# EAGLE design ledrgbmatrix_arjun_with10mil clearence (EAGLE 7.7.0)
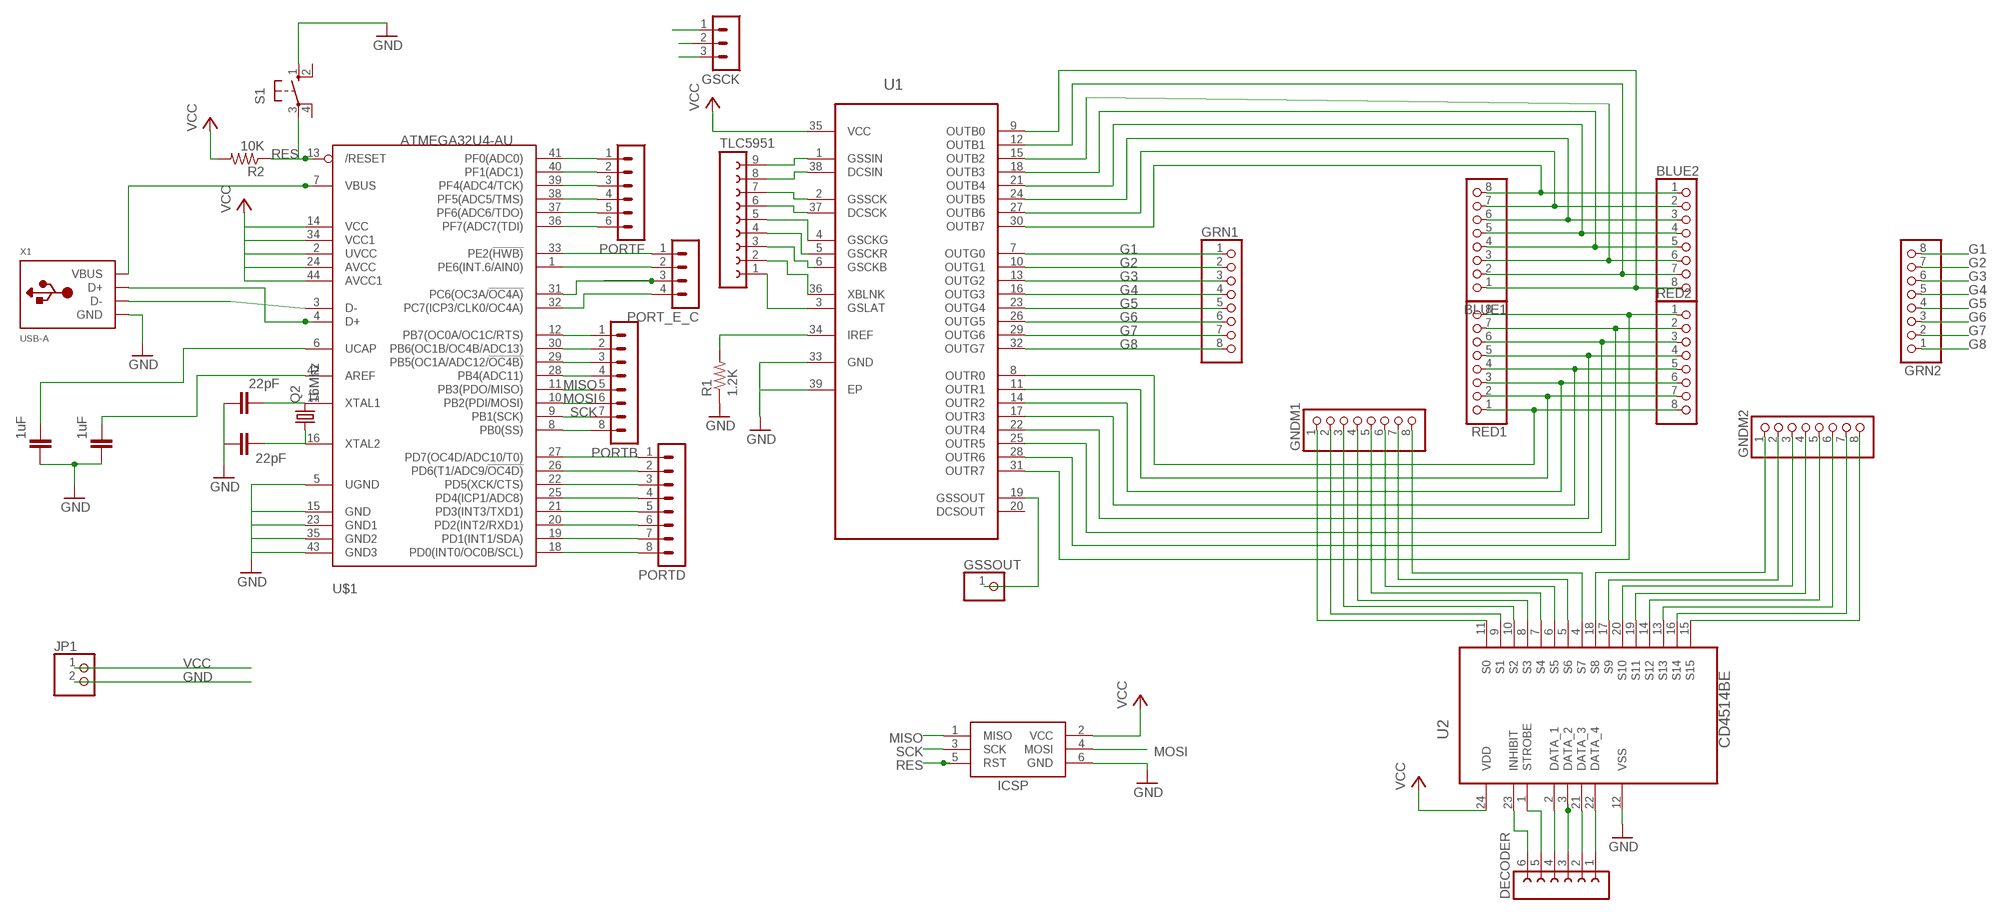
[diagram p0: schematic, sheet 1]

## Parts
BLUE1  PINHD-1X8BIG  [1X08-BIG]
BLUE2  PINHD-1X8BIG  [1X08-BIG]
C1  1uF  C2.5/2  [C2.5-2]
C2  1uF  C2.5/2  [C2.5-2]
C3  22pF  C2.5/2  [C2.5-2]
C4  22pF  C2.5/2  [C2.5-2]
DECODER  FE06-1  [FE06]
GNDM1  PINHD-1X8BIG  [1X08-BIG]
GNDM2  PINHD-1X8BIG  [1X08-BIG]
GRN1  PINHD-1X8BIG  [1X08-BIG]
GRN2  PINHD-1X8BIG  [1X08-BIG]
GSCK  MA03-1  [MA03-1]
GSSOUT  PINHD-1X1  [1X01]
ICSP  AVRISP-6  [AVRISP]
JP1  PINHD-1X2  [1X02]
PORT_E_C  MA04-1  [MA04-1]
PORTB  MA08-1  [MA08-1]
PORTD  MA08-1  [MA08-1]
PORTF  MA06-1  [MA06-1]
Q2  16Mhz  CRYSTALHC49U-V  [HC49U-V]
R1  1.2K  R-US_0207/12  [0207/12]
R2  10K  R-US_0207/12  [0207/12]
RED1  PINHD-1X8BIG  [1X08-BIG]
RED2  PINHD-1X8BIG  [1X08-BIG]
S1  10-XX  [B3F-10XX]
TLC5951  FE09-1  [FE09]
U1  TLC5951DAP  [SOP65P810X120-39N]
U2  CD4514BE  [DIP254P1080X508-24]
U$1  ATMEGA32U4-AU  [TQFP44]
X1  USB-A  [MOLEX_480371000]

## Nets
AREF: C1.2 U$1.42(AREF)
B1: BLUE1.1 BLUE2.8 U1.9(OUTB0)
B2: BLUE1.2 BLUE2.7 U1.12(OUTB1)
B3: BLUE1.3 BLUE2.6 U1.15(OUTB2)
B4: BLUE1.4 BLUE2.5 U1.18(OUTB3)
B5: BLUE1.5 BLUE2.4 U1.21(OUTB4)
B6: BLUE1.6 BLUE2.3 U1.24(OUTB5)
B7: BLUE1.7 BLUE2.2 U1.27(OUTB6)
B8: BLUE1.8 BLUE2.1 U1.30(OUTB7)
C0: GNDM1.1 U2.11(S0)
C1: GNDM1.2 U2.9(S1)
C2: GNDM1.3 U2.10(S2)
C3: GNDM1.4 U2.8(S3)
C4: GNDM1.5 U2.7(S4)
C5: GNDM1.6 U2.6(S5)
C6: GNDM1.7 U2.5(S6)
C7: GNDM1.8 U2.4(S7)
C8: GNDM2.1 U2.18(S8)
C9: GNDM2.2 U2.17(S9)
C10: GNDM2.3 U2.20(S10)
C11: GNDM2.4 U2.19(S11)
C12: GNDM2.5 U2.14(S12)
C13: GNDM2.6 U2.13(S13)
C14: GNDM2.7 U2.16(S14)
C15: GNDM2.8 U2.15(S15)
D1: DECODER.4 U2.2(DATA_1)
D2: DECODER.3 U2.3(DATA_2)
D3: DECODER.2 U2.21(DATA_3)
D4: DECODER.1 U2.22(DATA_4)
D+: U$1.4(D+) X1.3(D+)
D-: U$1.3(D-) X1.2(D-)
DCSCK: TLC5951.6 U1.37(DCSCK)
DSCIN: TLC5951.8 U1.38(DCSIN)
G1: GRN1.1 GRN2.8 U1.7(OUTG0)
G2: GRN1.2 GRN2.7 U1.10(OUTG1)
G3: GRN1.3 GRN2.6 U1.13(OUTG2)
G4: GRN1.4 GRN2.5 U1.16(OUTG3)
G5: GRN1.5 GRN2.4 U1.23(OUTG4)
G6: GRN1.6 GRN2.3 U1.26(OUTG5)
G7: GRN1.7 GRN2.2 U1.29(OUTG6)
G8: GRN1.8 GRN2.1 U1.32(OUTG7)
GND: C1.1 C2.1 C3.1 C4.1 ICSP.6(GND) JP1.2 R1.1 S1.1(S) U1.33(GND) U1.39(EP) U2.12(VSS) U$1.5(UGND) U$1.15(GND) U$1.23(GND1) U$1.35(GND2) U$1.43(GND3) X1.4(GND)
GSCKB: TLC5951.3 U1.6(GSCKB)
GSCKG: TLC5951.5 U1.4(GSCKG)
GSCKR: TLC5951.4 U1.5(GSCKR)
GSLAT: TLC5951.1 U1.3(GSLAT)
GSSCK: GSCK.2 TLC5951.7 U1.2(GSSCK)
GSSIN: TLC5951.9 U1.1(GSSIN)
GSSOUT: GSSOUT.1 U1.19(GSSOUT)
INHIBIT: DECODER.6 U2.23(INHIBIT)
IREF: R1.2 U1.34(IREF)
MISO: ICSP.1(MISO) PORTB.5 U$1.11(PB3(PDO/MISO))
MOSI: ICSP.4(MOSI) PORTB.6 U$1.10(PB2(PDI/MOSI))
PB0: PORTB.8 U$1.8(PB0(SS))
PB4: PORTB.4 U$1.28(PB4(ADC11))
PB5: PORTB.3 U$1.29(PB5(OC1A/ADC12/!OC4B))
PB6: PORTB.2 U$1.30(PB6(OC1B/OC4B/ADC13))
PB7: PORTB.1 U$1.12(PB7(OC0A/OC1C/RTS))
PC6: PORT_E_C.3 U$1.31(PC6(OC3A/!OC4A))
PC7: PORT_E_C.4 U$1.32(PC7(ICP3/CLK0/OC4A))
PD0: PORTD.8 U$1.18(PD0(INT0/OC0B/SCL))
PD1: PORTD.7 U$1.19(PD1(INT1/SDA))
PD2: PORTD.6 U$1.20(PD2(INT2/RXD1))
PD3: PORTD.5 U$1.21(PD3(INT3/TXD1))
PD4: PORTD.4 U$1.25(PD4(ICP1/ADC8))
PD5: PORTD.3 U$1.22(PD5(XCK/CTS))
PD6: PORTD.2 U$1.26(PD6(T1/ADC9/!OC4D))
PD7: PORTD.1 U$1.27(PD7(OC4D/ADC10/T0))
PE2: PORT_E_C.1 U$1.33(PE2(!HWB))
PE6: PORT_E_C.2 U$1.1(PE6(INT.6/AIN0))
PF0: PORTF.1 U$1.41(PF0(ADC0))
PF1: PORTF.2 U$1.40(PF1(ADC1))
PF4: PORTF.3 U$1.39(PF4(ADC4/TCK))
PF5: PORTF.4 U$1.38(PF5(ADC5/TMS))
PF6: PORTF.5 U$1.37(PF6(ADC6/TDO))
PF7: PORTF.6 U$1.36(PF7(ADC7(TDI))
R1: RED1.1 RED2.8 U1.8(OUTR0)
R2: RED1.2 RED2.7 U1.11(OUTR1)
R3: RED1.3 RED2.6 U1.14(OUTR2)
R4: RED1.4 RED2.5 U1.17(OUTR3)
R5: RED1.5 RED2.4 U1.22(OUTR4)
R6: RED1.6 RED2.3 U1.25(OUTR5)
R7: RED1.7 RED2.2 U1.28(OUTR6)
R8: RED1.8 RED2.1 U1.31(OUTR7)
RES: ICSP.5(RST) R2.1 S1.3(P) U$1.13(/RESET)
SCK: ICSP.3(SCK) PORTB.7 U$1.9(PB1(SCK))
STROBE: DECODER.5 U2.1(STROBE)
UCAP: C2.2 U$1.6(UCAP)
VBUS: U$1.7(VBUS) X1.1(VBUS)
VCC: ICSP.2(VCC) JP1.1 R2.2 U1.35(VCC) U2.24(VDD) U$1.2(UVCC) U$1.14(VCC) U$1.24(AVCC) U$1.34(VCC1) U$1.44(AVCC1)
XBLINK: TLC5951.2 U1.36(XBLNK)
XTAL1: C3.2 Q2.2 U$1.17(XTAL1)
XTAL2: C4.2 Q2.1 U$1.16(XTAL2)
Unconnected: GSCK.1 GSCK.3 S1.2(S1) S1.4(P1) U1.20(DCSOUT)

## Library data of the parts
BLUE1 BLUE2 GNDM1 GNDM2 GRN1 GRN2 RED1 RED2 = adafruit:PINHD-1X8: PIN HEADER
C1-C4 = capacitor-wima:C: CAPACITOR naming: grid - package width
DECODER = con-lsta:FE06-1: FEMALE HEADER; OC_FARNELL: unknown; OC_NEWARK: unknown
GSCK = con-lstb:MA03-1: PIN HEADER; OC_FARNELL: unknown; OC_NEWARK: unknown
GSSOUT = pinhead:PINHD-1X1: PIN HEADER
ICSP = adafruit:AVRISP: AVR ISP HEADER Standard 6 pin header for AVR programming
JP1 = pinhead:PINHD-1X2: PIN HEADER
PORT_E_C = con-lstb:MA04-1: PIN HEADER; OC_FARNELL: unknown; OC_NEWARK: unknown
PORTB PORTD = con-lstb:MA08-1: PIN HEADER; OC_FARNELL: unknown; OC_NEWARK: unknown
PORTF = con-lstb:MA06-1: PIN HEADER; OC_FARNELL: unknown; OC_NEWARK: unknown
Q2 = adafruit:CRYSTAL: CRYSTAL; OC_FARNELL: 1666969; OC_NEWARK: unknown
R1 R2 = rcl:R-US_: RESISTOR, American symbol
S1 = switch-omron:10-XX: OMRON SWITCH; MPN: B3F-1000; OC_FARNELL: 176432; OC_NEWARK: 36M3542
TLC5951 = con-lsta:FE09-1: FEMALE HEADER; OC_FARNELL: unknown; OC_NEWARK: unknown
U1 = Texas Instruments_By_element14_Batch_1:TLC5951DAP: 12-Bit PWM LED Driver; MPN: TLC5951DAP; OC_FARNELL: -; OC_NEWARK: 09R6488; PACKAGE: HTSSOP-38; SUPPLIER: Texas Instruments
U2 = Texas Instruments_By_element14_Batch_1:CD4514BE: CMOS 4 BIT LATCH /4-16 LINE DECODER; MPN: CD4514BE; OC_FARNELL: 1470801; OC_NEWARK: 60K5142; PACKAGE: 24-DIP; SUPPLIER: Texas Instruments
U$1 = adafruit:ATMEGA32U4: http://www.ladyada.net/library/eagle
X1 = adafruit:USB-A: USB type A 'plug' Used for things that can directly connect to a USB port, say USB key

## Net classes
0 default: width 0.254 mm, drill 0.508 mm, clearance 0.254 mm

## Board
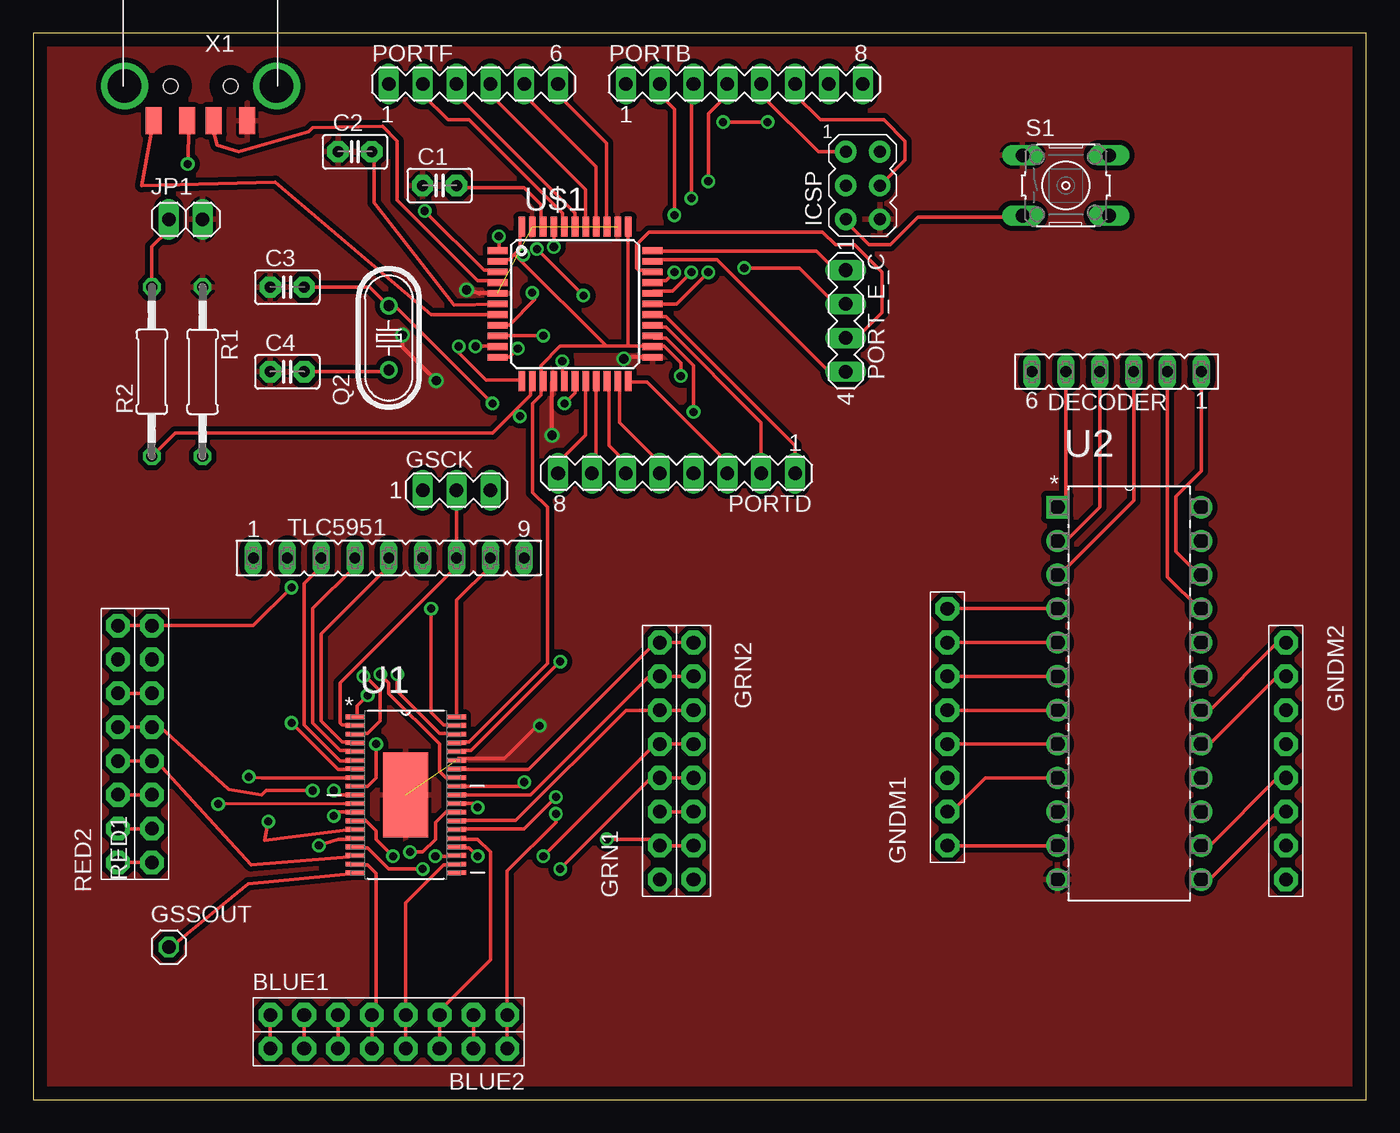
[diagram p1: board, top side]
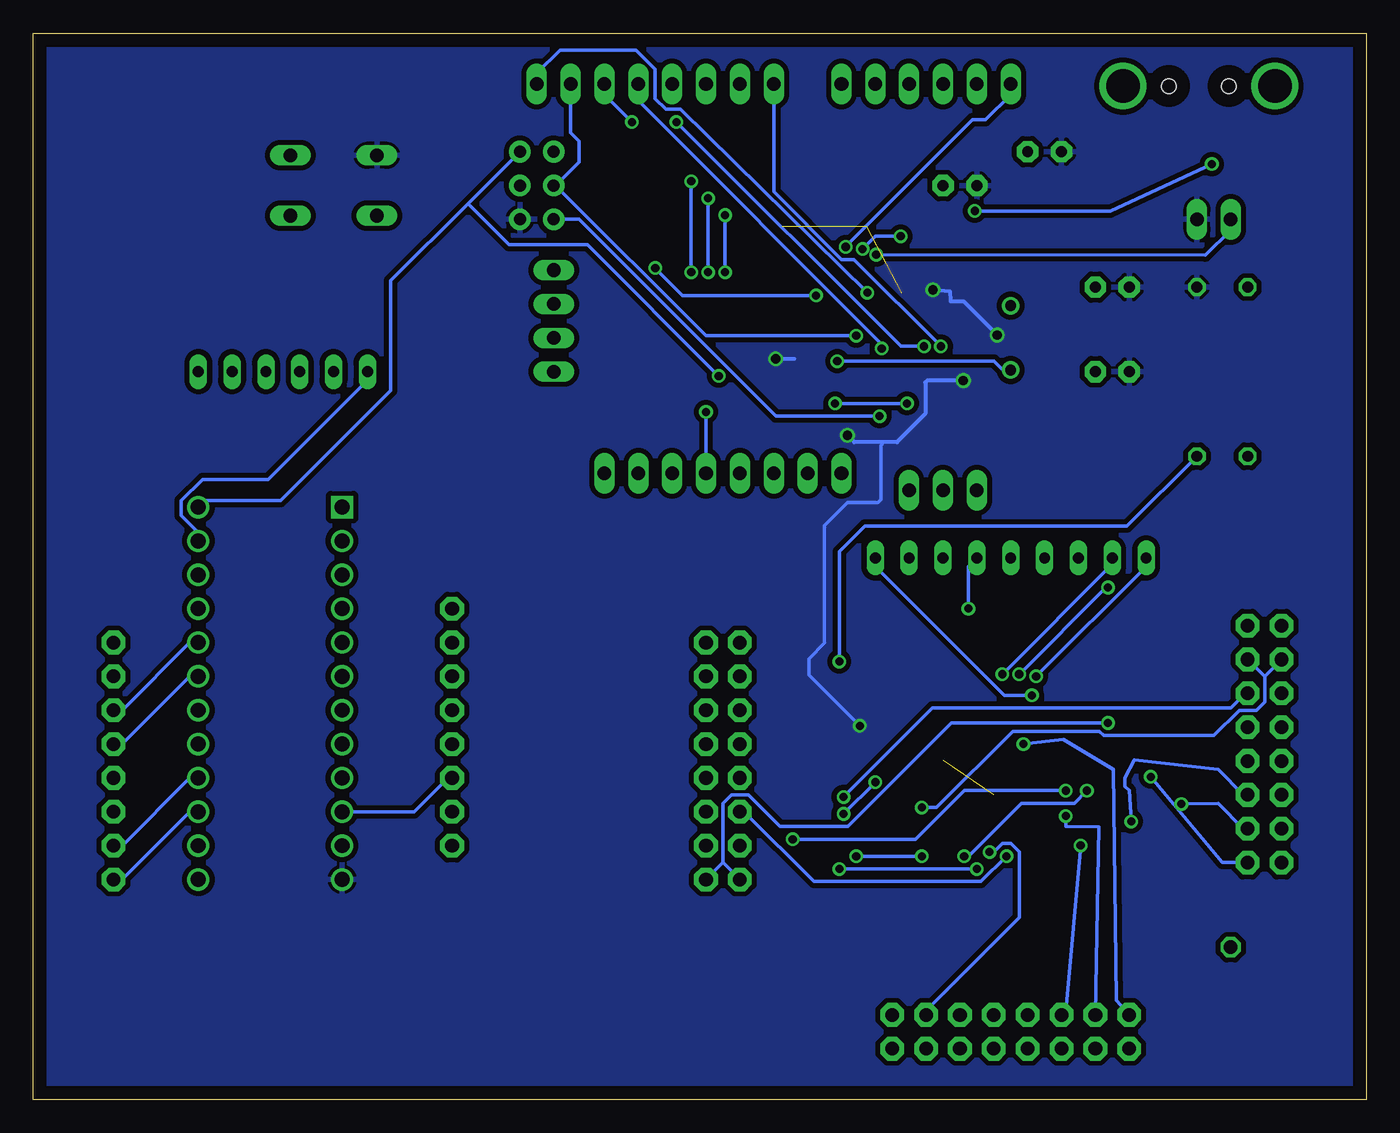
[diagram p2: board, bottom side, seen from below]

Size 100 x 80 mm. Coordinates in mm from the lower left corner, seen from the top.
Outline: 0,0 100,0 100,80 0,80 0,0
Copper layers (1*16): Top 0.035mm / dielectric 1.5mm / Bottom 0.035mm
Design rules "default *": minimum track width 10mil, minimum drill 24mil, track to track 15mil, track to pad 15mil, pad to pad 8mil, via to via 15mil, smd to smd 8mil, copper to edge 40mil, drill to drill 8mil, minimum pad ring 10mil, minimum via ring 8mil, stop-mask expansion 4mil, vias tented up to drill 0mil, thermal gap 10mil

### Footprints (pad centres in the part's own frame; a part is rotated, then mirrored left to right if it is on the bottom)
1X08-BIG = drill 1.016 pad 1.778 octagon: 1 -8.89,0; 2 -6.35,0; 3 -3.81,0; 4 -1.27,0; 5 1.27,0; 6 3.81,0; 7 6.35,0; 8 8.89,0
C2.5-2 = drill 0.813 pad 1.6 octagon: 1 -1.27,0; 2 1.27,0
FE06 = drill 0.813 long: 1 -6.35,0; 2 -3.81,0; 3 -1.27,0; 4 1.27,0; 5 3.81,0; 6 6.35,0
MA03-1 = drill 1.016 long: 1 -2.54,0; 2 0,0; 3 2.54,0
1X01 = drill 1.016 octagon: 1 0,0
AVRISP = drill 0.9 pad 1.626: 1 -1.27,2.54; 2 1.27,2.54; 3 -1.27,0; 4 1.27,0; 5 -1.27,-2.54; 6 1.27,-2.54
1X02 = drill 1.016 long: 1 -1.27,0; 2 1.27,0
MA04-1 = drill 1.016 long: 1 -3.81,0; 2 -1.27,0; 3 1.27,0; 4 3.81,0
MA08-1 = drill 1.016 long: 1 -8.89,0; 2 -6.35,0; 3 -3.81,0; 4 -1.27,0; 5 1.27,0; 6 3.81,0; 7 6.35,0; 8 8.89,0
MA06-1 = drill 1.016 long: 1 -6.35,0; 2 -3.81,0; 3 -1.27,0; 4 1.27,0; 5 3.81,0; 6 6.35,0
HC49U-V = drill 0.813: 1 -2.413,0; 2 2.413,0
0207/12 = drill 0.813 octagon: 1 -6.35,0; 2 6.35,0
B3F-10XX = drill 1.016 long: 1 -3.251,2.261; 2 3.251,2.261; 3 -3.251,-2.261; 4 3.251,-2.261
FE09 = drill 0.813 long: 1 -10.16,0; 2 -7.62,0; 3 -5.08,0; 4 -2.54,0; 5 0,0; 6 2.54,0; 7 5.08,0; 8 7.62,0; 9 10.16,0
SOP65P810X120-39N = smd 1.473 x 0.356: 1 -3.785,5.842; 2 -3.785,5.207; 3 -3.785,4.547; 4 -3.785,3.912; 5 -3.785,3.251; 6 -3.785,2.591; 7 -3.785,1.956; 8 -3.785,1.295; 9 -3.785,0.66; 10 -3.785,0; 11 -3.785,-0.66; 12 -3.785,-1.295; 13 -3.785,-1.956; 14 -3.785,-2.591; 15 -3.785,-3.251; 16 -3.785,-3.912; 17 -3.785,-4.547; 18 -3.785,-5.207; 19 -3.785,-5.842; 20 3.785,-5.842; 21 3.785,-5.207; 22 3.785,-4.547; 23 3.785,-3.912; 24 3.785,-3.251; 25 3.785,-2.591; 26 3.785,-1.956; 27 3.785,-1.295; 28 3.785,-0.66; 29 3.785,0; 30 3.785,0.66; 31 3.785,1.295; 32 3.785,1.956; 33 3.785,2.591; 34 3.785,3.251; 35 3.785,3.912; 36 3.785,4.547; 37 3.785,5.207; 38 3.785,5.842 | smd 3.378 x 6.35: 39 0,0
DIP254P1080X508-24 = drill 1.118 square: 1 -10.795,27.94 | drill 1.118: 2 -10.795,25.4; 3 -10.795,22.86; 4 -10.795,20.32; 5 -10.795,17.78; 6 -10.795,15.24; 7 -10.795,12.7; 8 -10.795,10.16; 9 -10.795,7.62; 10 -10.795,5.08; 11 -10.795,2.54; 12 -10.795,0; 13 0,0; 14 0,2.54; 15 0,5.08; 16 0,7.62; 17 0,10.16; 18 0,12.7; 19 0,15.24; 20 0,17.78; 21 0,20.32; 22 0,22.86; 23 0,25.4; 24 0,27.94
TQFP44 = smd 1.5 x 0.5: 1 -5.8,4; 2 -5.8,3.2; 3 -5.8,2.4; 4 -5.8,1.6; 5 -5.8,0.8; 6 -5.8,0; 7 -5.8,-0.8; 8 -5.8,-1.6; 9 -5.8,-2.4; 10 -5.8,-3.2; 11 -5.8,-4; 23 5.8,-4; 24 5.8,-3.2; 25 5.8,-2.4; 26 5.8,-1.6; 27 5.8,-0.8; 28 5.8,0; 29 5.8,0.8; 30 5.8,1.6; 31 5.8,2.4; 32 5.8,3.2; 33 5.8,4 | smd 0.5 x 1.5: 12 -4,-5.8; 13 -3.2,-5.8; 14 -2.4,-5.8; 15 -1.6,-5.8; 16 -0.8,-5.8; 17 0,-5.8; 18 0.8,-5.8; 19 1.6,-5.8; 20 2.4,-5.8; 21 3.2,-5.8; 22 4,-5.8; 34 4,5.8; 35 3.2,5.8; 36 2.4,5.8; 37 1.6,5.8; 38 0.8,5.8; 39 0,5.8; 40 -0.8,5.8; 41 -1.6,5.8; 42 -2.4,5.8; 43 -3.2,5.8; 44 -4,5.8
MOLEX_480371000 = smd 1.2 x 2: 1 3.5,2.6; 2 1,2.6; 3 -1,2.6; 4 -3.5,2.6 | drill 2.5: M1 -5.7,0; M2 5.7,0 | hole 1.1: -2.25,0; 2.25,0

### Placement (x,y rotation side)
BLUE1  26.67,6.35 0 top
BLUE2  26.67,3.81 180 top
C1  30.48,68.58 0 top
C2  24.13,71.12 0 top
C3  19.05,60.96 0 top
C4  19.05,54.61 0 top
DECODER  81.28,54.61 180 top
GNDM1  68.58,27.94 90 top
GNDM2  93.98,25.4 270 top
GRN1  46.99,25.4 90 top
GRN2  49.53,25.4 270 top
GSCK  31.75,45.72 0 top
GSSOUT  10.16,11.43 0 top
ICSP  62.23,68.58 0 top
JP1  11.43,66.04 0 top
PORT_E_C  60.96,58.42 270 top
PORTB  53.34,76.2 0 top
PORTD  48.26,46.99 180 top
PORTF  33.02,76.2 0 top
Q2  26.67,57.15 90 top
R1  12.7,54.61 270 top
R2  8.89,54.61 90 top
RED1  8.89,26.67 90 top
RED2  6.35,26.67 270 top
S1  77.47,68.58 0 top
TLC5951  26.67,40.64 0 top
U1  27.94,22.86 0 top
U2  87.63,16.51 0 top
U$1  40.64,59.69 0 top
X1  12.55,76.05 180 top

### Tracks (layer width: path | path; a pad name or v marks a point on that pad's centre or on a via)
AREF
  Top 0.254: C1.2 31.91,68.42 36.83,68.42 38.1,67.15 38.1,65.56 U$1.42
B1  (via drill 0.61)
  Top 0.254: v25.72,26.67 25.72,24.13 25.08,23.5 24.29,23.5 U1.9 | BLUE1.1 BLUE2.8
  Bottom 0.254: v25.72,26.67 22.72,27.03 18.99,24.77 18.73,7.46 BLUE1.1
B2  (via drill 0.61)
  Top 0.254: v22.54,21.27 22.86,21.59 24.13,21.59 U1.12 | BLUE1.2 BLUE2.7
  Bottom 0.254: v22.54,21.27 22.54,20.48 20.07,20.44 BLUE1.2
B3  (via drill 0.61)
  Top 0.254: v21.43,19.06 22.86,19.53 24.13,19.53 U1.15 | BLUE1.3 BLUE2.6
  Bottom 0.254: v21.43,19.06 22.54,6.67 BLUE1.3
B4
  Top 0.254: U1.18 24.29,17.62 25.08,17.62 25.72,16.99 25.72,6.67 BLUE1.4 BLUE2.5
B5
  Top 0.254: U1.21 31.59,17.62 30.8,17.62 27.94,14.76 BLUE1.5 BLUE2.4
B6
  Top 0.254: U1.24 31.75,19.53 33.34,19.53 34.29,18.57 34.29,10.48 30.48,6.67 BLUE1.6 BLUE2.3
B7  (via drill 0.61)
  Top 0.254: v28.26,18.57 29.21,18.57 30.16,19.53 30.16,20.8 30.96,21.59 31.59,21.59 U1.27 | BLUE1.7 BLUE2.2
  Bottom 0.254: v28.26,18.57 27.94,18.57 27.3,19.21 26.67,19.21 26.04,18.57 26.04,13.65 33.02,6.67 BLUE1.7
B8  (via drill 0.61)
  Top 0.254: v36.83,23.81 36.51,23.5 31.75,23.5 U1.30 | v39.21,21.43 39.21,20.8 35.56,17.14 BLUE1.8 BLUE2.1
  Bottom 0.254: v39.21,21.43 v36.83,23.81
C0
  Top 0.254: GNDM1.1 U2.11
C1
  Top 0.254: U2.9 71.44,24.13 68.9,21.59 GNDM1.2
C2
  Bottom 0.254: U2.10 71.44,21.59 68.9,24.13 GNDM1.3
C3
  Top 0.254: GNDM1.4 U2.8
C4
  Top 0.254: GNDM1.5 U2.7
C5
  Top 0.254: GNDM1.6 U2.6
C6
  Top 0.254: GNDM1.7 U2.5
C7
  Top 0.254: GNDM1.8 U2.4
C8
  Top 0.254: U2.18 88.27,29.21 93.34,34.29 GNDM2.1
C9
  Top 0.254: U2.17 88.27,26.67 93.34,31.75 GNDM2.2
C10
  Bottom 0.254: U2.20 88.27,34.29 93.34,29.21 GNDM2.3
C11
  Bottom 0.254: U2.19 88.27,31.75 93.34,26.67 GNDM2.4
C12
  Top 0.254: U2.14 88.27,19.05 93.34,24.13 GNDM2.5
C13
  Top 0.254: U2.13 88.27,16.51 93.34,21.59 GNDM2.6
C14
  Bottom 0.254: U2.16 88.27,24.13 93.34,19.05 GNDM2.7
C15
  Bottom 0.254: U2.15 88.27,21.59 93.34,16.51 GNDM2.8
D1
  Top 0.254: DECODER.4 80.01,44.45 77.47,41.91 U2.2
D2
  Top 0.254: DECODER.3 82.55,44.93 76.99,39.37 U2.3
D3
  Top 0.254: DECODER.2 85.09,39.21 87.47,36.83 U2.21
D4
  Top 0.254: DECODER.1 87.63,47.15 85.72,45.24 85.72,41.12 87.47,39.37 U2.22
D+
  Top 0.254: U$1.4 34.77,61.44 33.34,61.44 27.3,67.47 27.3,71.91 26.19,73.03 20.96,72.92 20.64,72.61 15.39,71.13 13.81,71.6 13.51,72.74 X1.3
D-  (via drill 0.61)
  Top 0.254: v29.37,66.67 33.81,62.23 34.77,62.23 U$1.3 | v11.58,70.19 11.75,74.14 11.75,72.99 X1.2
  Bottom 0.254: v29.37,66.67 19.21,66.67 v11.58,70.19
DCSCK  (via drill 0.61)
  Top 0.254: v29.84,36.83 29.84,29.05 30.8,28.1 31.59,28.1 U1.37
  Bottom 0.254: v29.84,36.83 29.84,40.01 TLC5951.6
DSCIN
  Top 0.254: TLC5951.8 34.29,40.01 31.75,37.47 31.75,28.73 U1.38
G1  (via drill 0.61)
  Top 0.254: v19.37,28.26 22.86,24.77 24.13,24.77 U1.7
  Bottom 0.254: v19.37,28.26 31.11,28.26 38.89,20.48 43.97,20.48 46.35,22.86 47.62,22.86 48.26,22.23 48.26,17.78 | GRN1.1 48.26,17.78 | 48.26,17.78 GRN2.8
G2  (via drill 0.61)
  Top 0.254: U1.10 22.86,22.86 v22.54,23.18 | v43.02,19.53 46.51,19.53 GRN1.2 GRN2.7
  Bottom 0.254: v22.54,23.18 30.16,23.18 33.81,19.53 v43.02,19.53
G3  (via drill 0.61)
  Top 0.254: v26.99,18.26 25.72,19.53 25.72,20.16 24.92,20.95 24.29,20.95 U1.13 | GRN1.3 GRN2.6
  Bottom 0.254: v26.99,18.26 28.89,16.35 41.43,16.35 46.67,21.59 GRN1.3
G4  (via drill 0.61)
  Top 0.254: v29.21,17.3 26.67,17.3 25.08,18.89 24.29,18.89 U1.16 | v39.53,17.3 46.35,24.13 GRN1.4 GRN2.5
  Bottom 0.254: v39.53,17.3 v29.21,17.3
G5  (via drill 0.61)
  Top 0.254: v33.34,18.26 32.7,18.89 31.75,18.89 U1.23 | v38.26,18.26 46.67,26.67 GRN1.5 GRN2.4
  Bottom 0.254: v38.26,18.26 v33.34,18.26
G6
  Top 0.254: U1.26 31.75,20.95 36.2,20.95 44.45,29.21 GRN1.6 GRN2.3
G7
  Top 0.254: U1.29 37.31,22.86 46.2,31.75 GRN1.7 GRN2.2
G8
  Top 0.254: U1.32 31.75,24.77 37.15,24.77 46.67,34.29 GRN1.8 GRN2.1
GND  (via drill 0.6 pad 0.41, 0.7 pad 0.3)  (3 unrouted)
  Top 0.254: v38,28.04 37.8,28.04 35.36,25.6 31.88,25.6 U1.33
  Top 0.305: U$1.5 33.49,60.49 33.48,60.5 33.48,60.45 v32.51,60.76 | v27.69,57.35 27.69,56.49 v30.23,53.95 | v38.91,49.84 38.91,53.76 U$1.15 | U$1.23 44.41,55.69 v44.3,55.58
  Bottom 0.254: 35.2,49.33 36.17,49.33 36.42,49.07 36.42,45.01 36.63,44.81 38.91,44.81 40.64,43.08 40.64,34.24 41.81,33.07 41.81,31.85 v38,28.04
  Bottom 0.305: v32.51,60.76 31.24,60.66 31.19,59.89 30.23,59.89 v27.69,57.35 | v30.23,53.95 32.92,53.95 33.07,53.8 33.07,51.46 35.2,49.33 38.41,49.33 v38.91,49.84 | v44.3,55.58 42.93,55.58
  pour Bottom: 0,0 100.33,0 100.33,80.01 0,80.01 0,74.93
  pour Top: 0,80.01 100.33,80.01 100.33,0 0,0 0,5.08
GSCKB
  Top 0.254: TLC5951.3 21.59,40.01 20.32,38.73 20.32,28.1 23.02,25.4 24.13,25.4 U1.6
GSCKG
  Top 0.254: TLC5951.5 26.67,40.01 21.59,34.92 21.59,28.42 23.18,26.83 24.13,26.83 U1.4
GSCKR
  Top 0.254: TLC5951.4 24.13,40.01 20.95,36.83 20.95,28.26 23.02,26.19 24.13,26.19 U1.5
GSLAT  (via drill 0.61)
  Top 0.254: v24.77,31.75 24.92,31.75 26.04,30.64 26.04,28.42 25.08,27.46 24.29,27.46 U1.3
  Bottom 0.254: v24.77,31.75 16.51,40.01 TLC5951.1
GSSCK
  Top 0.254: U1.2 24.13,28.1 23.18,28.1 23.02,28.26 23.02,31.27 31.75,40.01 TLC5951.7 GSCK.2
GSSIN  (via drill 0.61)
  Top 0.254: v25.08,30.32 24.29,29.53 24.29,28.73 U1.1
  Bottom 0.254: v25.08,30.32 27.15,30.32 36.83,40.01 TLC5951.9
GSSOUT
  Top 0.254: GSSOUT.1 10.32,11.43 16.13,16.17 24.13,16.99 U1.19
INHIBIT
  Bottom 0.254: DECODER.6 74.93,53.98 82.39,46.51 87.31,46.51 88.9,44.93 88.9,43.81 87.63,42.55 U2.23
IREF  (via drill 0.61)
  Top 0.254: v39.53,32.86 32.86,26.19 31.75,26.19 U1.34
  Bottom 0.254: v39.53,32.86 39.53,41.12 37.62,43.02 17.94,43.02 R1.2
MISO  (via drill 0.61)
  Top 0.254: v36.35,56.36 35.72,55.72 34.92,55.72 U$1.11 | ICSP.1 58.9,71.12 54.61,75.41 PORTB.5
  Bottom 0.254: v36.35,56.36 36.35,56.67 54.61,74.93 PORTB.5
MOSI  (via drill 0.61)
  Top 0.254: v33.18,56.52 34.77,56.52 U$1.10 | v55.09,73.34 v51.75,73.34 | ICSP.4 65.41,70.48 65.41,71.91 63.82,73.5 59.05,73.5 57.15,75.41 PORTB.6
  Bottom 0.254: v33.18,56.52 34.92,56.52 v51.75,73.34 | v55.09,73.34 57.15,75.41 PORTB.6
PB0  (via drill 0.61)
  Top 0.254: v37.42,60.53 37.62,60.01 35.72,58.1 34.92,58.1 U$1.8
  Bottom 0.254: v37.42,60.53 51.44,74.3 52.55,74.3 53.34,75.09 53.34,77.31 54.77,78.74 60.48,78.74 62.23,76.99 PORTB.8
PB4  (via drill 0.61)
  Top 0.254: U$1.28 48.26,59.69 v50.64,62.07 | v50.64,68.9 50.64,73.98 52.07,75.41 PORTB.4
  Bottom 0.254: v50.64,68.9 v50.64,62.07
PB5  (via drill 0.61)
  Top 0.254: v49.37,62.07 47.94,60.64 46.51,60.64 U$1.29 | v49.37,67.63 49.37,76.04 PORTB.3
  Bottom 0.254: v49.37,67.63 v49.37,62.07
PB6  (via drill 0.61)
  Top 0.254: v48.1,62.07 47.47,61.44 46.51,61.44 U$1.30 | v48.1,66.36 48.1,74.3 46.99,75.41 PORTB.2
  Bottom 0.254: v48.1,66.36 v48.1,62.07
PB7  (via drill 0.61)
  Top 0.254: v31.91,56.52 31.91,56.04 33.97,53.98 36.51,53.98 U$1.12
  Bottom 0.254: v31.91,56.52 38.42,63.02 39.37,63.02 44.45,68.1 PORTB.1
PC6
  Top 0.254: PORT_E_C.3 61.75,57.15 63.66,59.05 63.66,62.07 61.59,64.14 60.17,64.14 59.21,65.09 46.2,65.09 45.24,64.14 45.24,62.39 45.4,62.23 46.35,62.23 U$1.31
PC7
  Top 0.254: PORT_E_C.4 59.69,54.61 51.28,63.02 46.51,63.02 U$1.32
PD0
  Top 0.254: PORTD.8 39.37,47.78 41.43,49.85 41.43,53.82 U$1.18
PD1
  Top 0.254: PORTD.7 42.23,47.31 42.23,53.82 U$1.19
PD2
  Top 0.254: PORTD.6 44.45,47.78 43.18,49.05 43.18,53.82 U$1.20
PD3
  Top 0.254: PORTD.5 46.99,47.78 43.97,50.8 43.97,53.82 U$1.21
PD4  (via drill 0.61)
  Top 0.254: v49.53,51.59 49.53,55.09 47.47,57.15 46.51,57.15 U$1.25
  Bottom 0.254: PORTD.4 v49.53,51.59
PD5
  Top 0.254: PORTD.3 52.07,47.78 46.04,53.82 44.77,53.82 U$1.22
PD6
  Top 0.254: PORTD.2 54.61,50.8 47.47,57.94 46.51,57.94 U$1.26
PD7
  Top 0.254: PORTD.1 57.15,49.05 47.47,58.74 46.51,58.74 U$1.27
PE2
  Top 0.254: PORT_E_C.1 60.17,62.23 58.74,63.66 46.51,63.66 U$1.33
PE6  (via drill 0.61)
  Top 0.254: v34.92,64.77 34.92,63.82 U$1.1 | v41.27,60.33 v37.78,63.82 | v53.34,62.39 57.47,62.39 60.17,59.69 PORT_E_C.2
  Bottom 0.254: v34.92,64.77 36.83,64.77 v37.78,63.82 | v41.27,60.33 51.28,60.33 v53.34,62.39
PF0  (via drill 0.61)
  Top 0.254: v39.05,63.98 39.05,65.41 U$1.41
  Bottom 0.254: v39.05,63.98 29.53,73.5 28.57,73.5 26.67,75.41 PORTF.1
PF1
  Top 0.254: PORTF.2 29.21,75.41 31.11,73.5 32.7,73.5 39.69,66.52 39.69,65.56 U$1.40
PF4
  Top 0.254: U$1.39 40.64,66.52 31.75,75.41 PORTF.3
PF5
  Top 0.254: PORTF.4 34.29,75.41 41.43,68.26 41.43,65.56 U$1.38
PF6
  Top 0.254: PORTF.5 36.83,75.41 42.23,70.01 42.23,65.56 U$1.37
PF7
  Top 0.254: PORTF.6 39.37,75.41 43.02,71.75 43.02,65.56 U$1.36
R1  (via drill 0.61)
  Top 0.254: v16.17,24.22 17.14,24.13 24.13,24.13 U1.8 | RED1.1 RED2.8
  Bottom 0.254: v16.17,24.22 10.79,17.78 RED1.1
R2  (via drill 0.61)
  Top 0.254: v13.87,22.17 24.13,22.23 U1.11 | RED1.2 RED2.7
  Bottom 0.254: v13.87,22.17 11.11,22.23 9.21,20.32 RED1.2
R3  (via drill 0.61)
  Top 0.254: v17.63,20.87 17.36,19.46 24.13,20.32 U1.14 | RED1.3 RED2.6
  Bottom 0.254: v17.63,20.87 17.78,23.18 18.1,23.5 18.1,24.13 17.41,25.48 11.11,24.77 9.21,22.86 RED1.3
R4
  Top 0.254: U1.17 24.13,18.26 16.35,17.6 9.21,25.4 RED1.4 RED2.5
R5  (via drill 0.61)
  Top 0.254: v30.16,18.26 31.59,18.26 U1.22 | v20.95,23.18 17.46,23.18 17.14,22.86 14.66,23.27 9.53,27.94 RED1.5 RED2.4
  Bottom 0.254: v30.16,18.26 29.84,18.26 25.88,22.23 21.91,22.23 v20.95,23.18
R6  (via drill 0.61)
  Top 0.254: v39.21,22.7 36.83,20.32 31.75,20.32 U1.25 | RED1.6 RED2.3
  Bottom 0.254: v39.21,22.7 32.54,29.37 10.16,29.37 9.05,30.48 RED1.6
R7  (via drill 0.61)
  Top 0.254: v33.34,21.91 33.02,22.23 31.75,22.23 U1.28
  Bottom 0.254: v33.34,21.91 32.23,21.91 26.51,27.62 20,27.62 19.68,27.3 11.43,27.3 9.53,29.21 8.26,29.21 7.62,29.84 7.62,31.75 | RED2.2 7.62,31.75 | 7.62,31.75 RED1.7
R8  (via drill 0.61)
  Top 0.254: v26.04,31.91 26.67,31.27 26.67,30.48 30.48,26.67 30.48,24.61 30.96,24.13 31.59,24.13 U1.31 | v19.37,38.42 16.51,35.56 RED1.8 RED2.1
  Bottom 0.254: v26.04,31.91 19.53,38.42 v19.37,38.42
RES  (via drill 0.61)
  Top 0.254: ICSP.5 60.96,65.88 62.71,64.14 64.29,64.14 66.36,66.2 74.14,66.2 S1.3 | 36.12,51.67 34.45,50.01 10.64,50.01 R2.1 | 36.12,51.67 37.31,52.86 37.31,53.82 U$1.13 | 36.12,51.67 v36.51,51.28
  Bottom 0.254: ICSP.5 59.05,66.04 44.29,51.28 v36.51,51.28
SCK  (via drill 0.61)
  Top 0.254: v38.26,57.31 34.92,57.31 U$1.9
  Bottom 0.254: v38.26,57.31 49.53,57.31 60.8,68.58 | PORTB.7 59.69,72.55 59.05,71.91 59.05,70.33 60.8,68.58 | 60.8,68.58 ICSP.3
STROBE
  Top 0.254: DECODER.5 77.47,45.09 U2.1
UCAP
  Top 0.254: U$1.6 31.55,59.59 25.56,67.31 25.56,70.96 C2.2
VBUS
  Top 0.254: U$1.7 34.77,58.9 29.84,58.9 18.14,68.82 8.12,68.57 8.85,72.51 8.85,73.15 X1.1
VCC  (via drill 0.61)
  Top 0.254: R2.2 8.89,63.98 10.16,65.25 JP1.1 | 36.12,63.42 36.51,63.82 36.51,65.41 U$1.44 | 36.12,63.42 35.72,63.02 34.92,63.02 U$1.2 | U1.35 31.75,26.83 32.7,26.83 38.58,32.7 38.58,44.45 37.47,45.56 37.47,52.23 38.1,52.86 38.1,53.82 U$1.14 38.1,53.98 38.1,55.09 39.53,56.52 43.02,56.52 | 43.02,56.52 44.61,56.52 | 44.61,56.52 46.35,56.52 U$1.24 46.51,56.52 47.31,56.52 48.58,55.24 v48.58,54.29 | 44.61,56.52 44.61,65.41 U$1.34 | 43.02,56.52 36.27,63.26 | 36.27,63.26 36.12,63.42 | v36.76,63.39 36.27,63.26
  Bottom 0.254: 67.39,67.23 73.18,61.44 73.18,53.18 81.44,44.93 87.15,44.93 U2.24 | 67.39,67.23 ICSP.2 | JP1.1 10.16,65.25 12.06,63.34 v36.76,63.39 | 67.39,67.23 64.29,64.14 58.42,64.14 v48.58,54.29
XBLINK  (via drill 0.61)
  Top 0.254: v27.3,31.91 27.3,30.64 30.48,27.46 31.59,27.46 U1.36
  Bottom 0.254: v27.3,31.91 19.05,40.16 TLC5951.2
XTAL1  (via drill 0.61)
  Top 0.254: U$1.17 40.64,53.02 v39.85,52.23 | v34.45,52.23 27.15,59.53 26.67,59.53 | C3.2 25.24,60.96 26.67,59.53 | 26.67,59.53 Q2.2
  Bottom 0.254: v34.45,52.23 v39.85,52.23
XTAL2  (via drill 0.61)
  Top 0.254: v39.69,55.4 39.69,53.98 U$1.16 | C4.2 26.67,54.61 Q2.1
  Bottom 0.254: v39.69,55.4 27.94,55.4 27.3,54.77 26.67,54.77 Q2.1